# EAGLE design prism_idx_support (EAGLE 6.5.0)
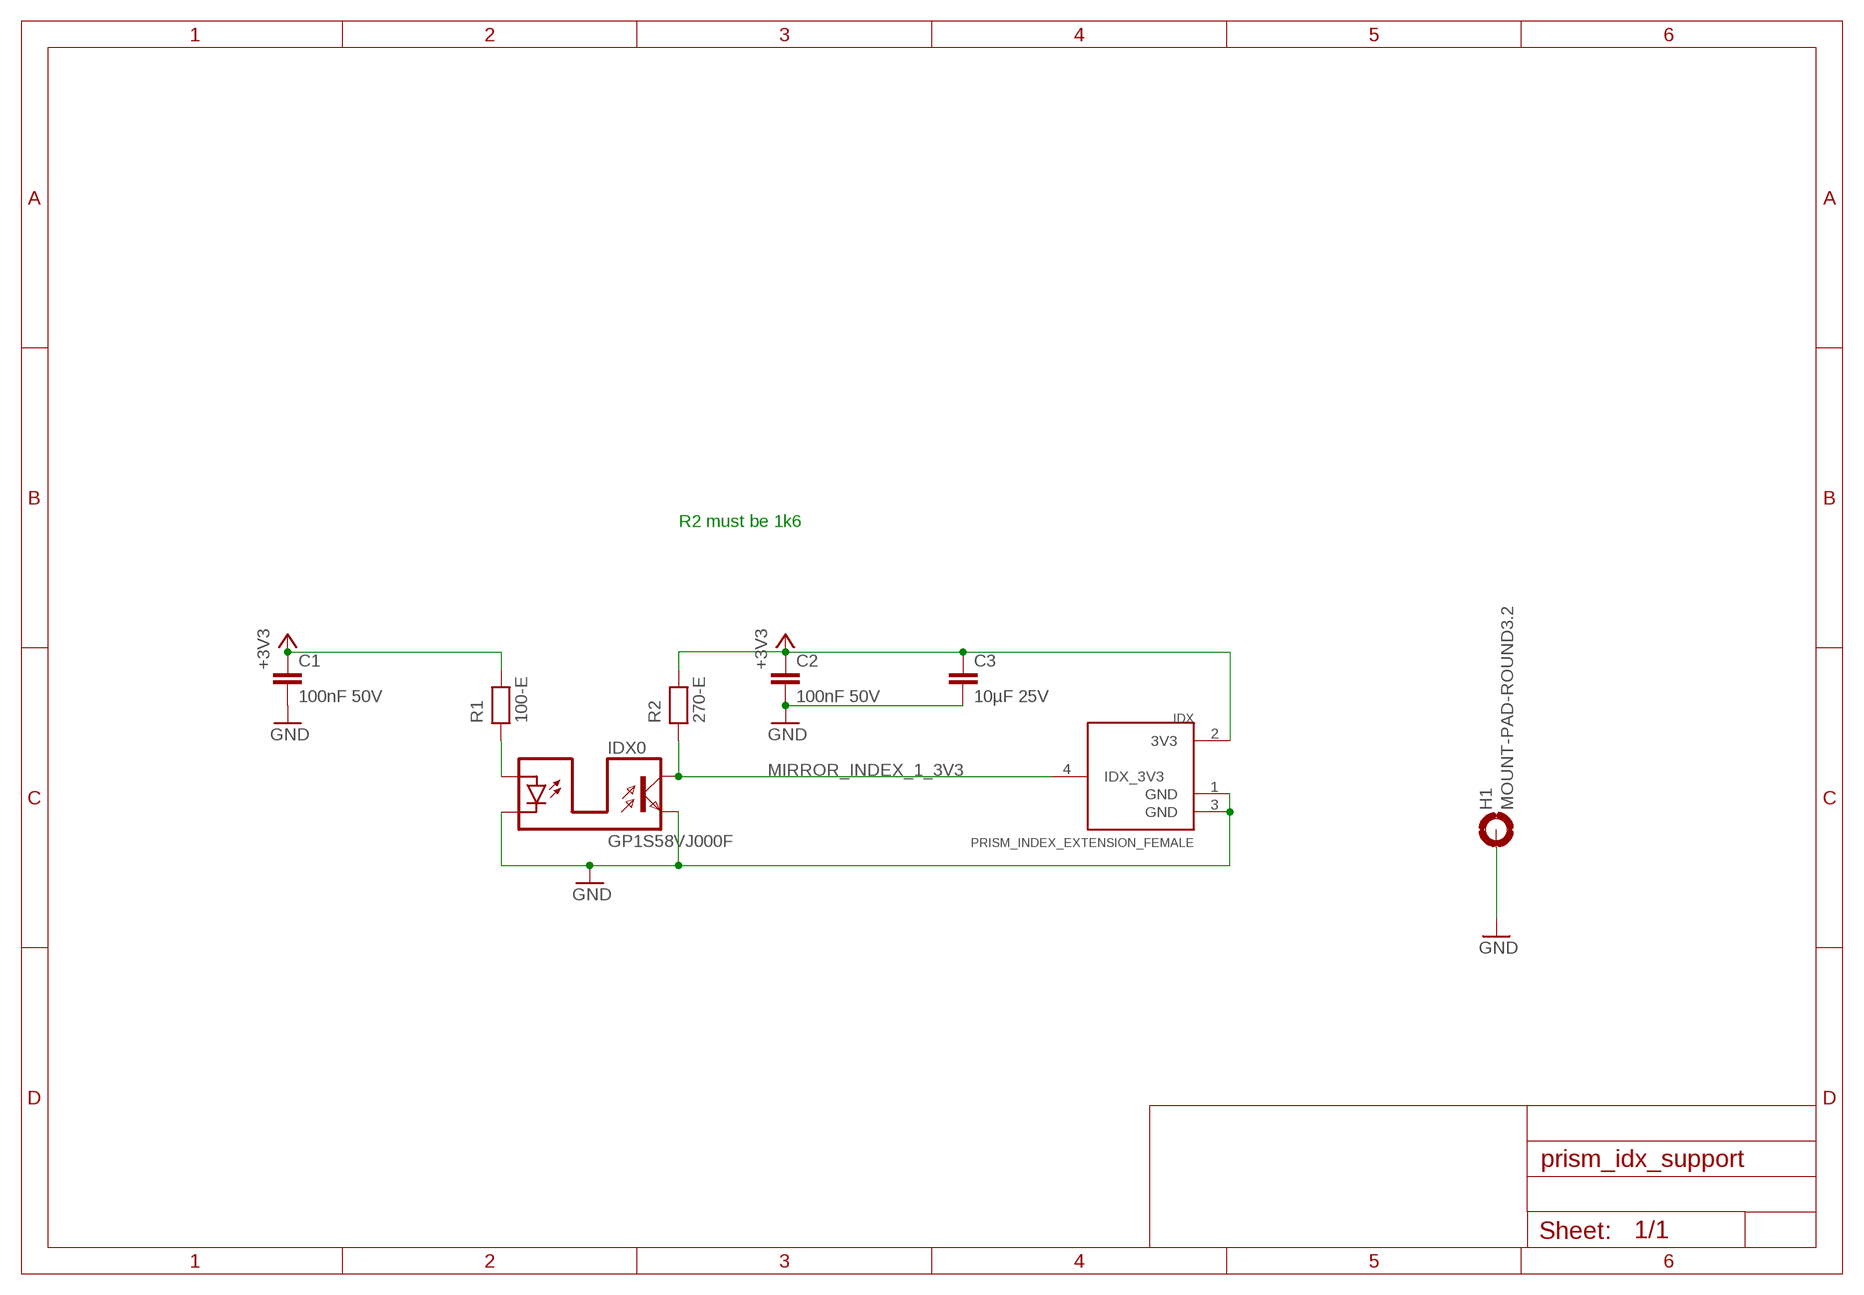
[diagram p0: schematic, sheet 1]

## Parts
C1  100nF 50V  100NF-F  [C0603]
C2  100nF 50V  100NF-F  [C0603]
C3  10µF 25V  10UF-C_25V  [C1210]
H1  MOUNT-PAD-ROUND3.2  [3,2-PAD]
IDX  PRISM_INDEX_EXTENSION_FEMALE  [PRISM_INDEX_EXTENSION_FEMALE]
IDX0  GP1S58VJ000F  [GP1S58VJ000F]
R1  100-E  [R0805]
R2  270-E  [R0805]

## Nets
+3V3: C1.1 C2.1 C3.1 IDX.2(3V3) R1.2 R2.2
GND: C1.2 C2.2 C3.2 H1.B3,2(MOUNT) IDX0.LED_C IDX0.TRANSISTOR_E IDX.1(GND) IDX.3(GND)
MIRROR_INDEX_1_3V3: IDX0.TRANSISTOR_C IDX.4(IDX_3V3) R2.1
N$57: IDX0.LED_A R1.1

## Notes on the sheet
- R2 must be 1k6

## Library data of the parts
C1 C2 = robotter_capacitor:100NF; MOUSER: 81-GRM188F51H104ZA01; RS: 723-5534
C3 = robotter_capacitor:10UF; MOUSER: 963-TMK316BJ106KL-T; RS: 766-1185
H1 = robotter_others:MOUNT-PAD-ROUND: MOUNTING PAD, round
IDX = robotter_others:PRISM_INDEX_EXTENSION
IDX0 = robotter_ic:GP1S58VJ000F: photo interrupter; MOUSER: 852-GP1S58VJ000F; RS: 667-5039
R1 = robotter_resistor:100; MOUSER: 603-AF0805FR-07100RL; RS: 223-0297
R2 = robotter_resistor:270; MOUSER: 652-CR0805-FX2700GLF; RS: 740-9019

## Board
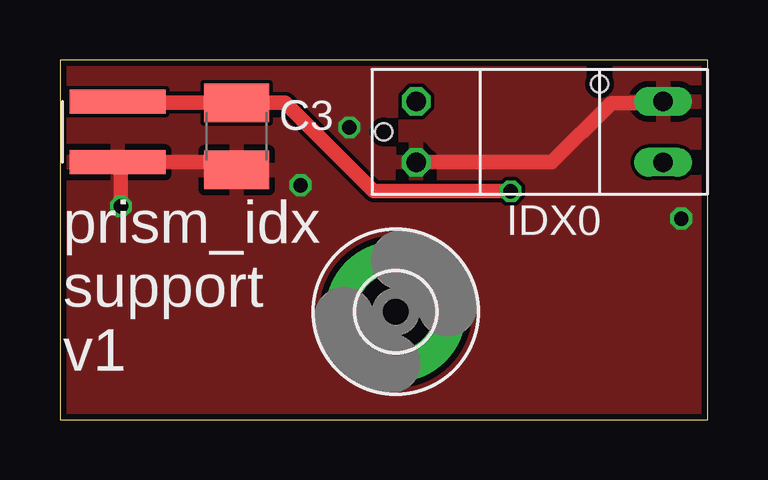
[diagram p1: board, top side]
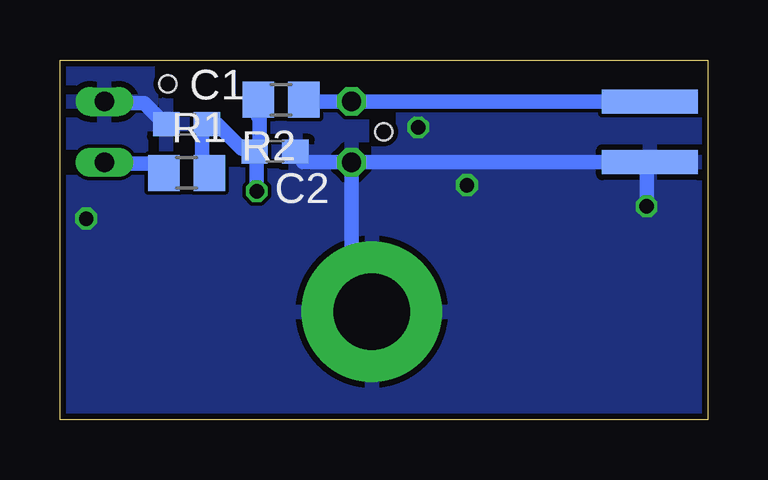
[diagram p2: board, bottom side, seen from below]

Size 27 x 15 mm. Coordinates in mm from the lower left corner, seen from the top.
Outline: 0,0 27,0 27,15 0,15 0,0
Copper layers (1*16): Top 0.035mm / dielectric 1.6mm / Bottom 0.035mm
Design rules "SeeedStudio_DRU_2layer": minimum track width 6mil, minimum drill 12mil, track to track 6mil, track to pad 6mil, pad to pad 6mil, via to via 6mil, smd to smd 0mil, copper to edge 10mil, drill to drill 10mil, minimum pad ring 6mil, minimum via ring 6mil, stop-mask expansion 2mil, vias tented up to drill 25mil, thermal gap 10mil

### Footprints (pad centres in the part's own frame; a part is rotated, then mirrored left to right if it is on the bottom)
C0603 = smd 1.1 x 1: 1 -0.85,0; 2 0.85,0
C1210 = smd 1.6 x 2.7: 1 -1.4,0; 2 1.4,0
3,2-PAD = drill 3.2 pad 5.842: B3,2 0,0
PRISM_INDEX_EXTENSION_FEMALE = smd 4 x 1: 1 0,-1.27; 2 0,1.27 | smd 4 x 1 bottom: 3 0,-1.27; 4 0,1.27
GP1S58VJ000F = drill 0.8 long: LED_A 5.15,-1.27; LED_C 5.15,1.27 | drill 0.8 octagon: TRANSISTOR_C -5.15,1.27; TRANSISTOR_E -5.15,-1.27 | hole 0.7: -6.5,0; 2.5,2
R0805 = smd 1.3 x 1.5: 1 -0.95,0; 2 0.95,0

### Placement (x,y rotation side)
C1  21.72,12.32 180 bottom
C2  18.03,11.18 0 bottom
C3  7.37,11.81 270 top
H1  14,4.5 0 top
IDX  2.4,12 0 top
IDX0  20,12 0 top
R1  21.72,10.29 0 bottom
R2  17.78,13.34 180 bottom

### Tracks (layer width: path | path; a pad name or v marks a point on that pad's centre or on a via)
+3V3  (via drill 0.6)
  Top 0.61: IDX.2 2.36,13.21 C3.1 9.39,13.21 13.08,9.53 v18.8,9.53
  Bottom 0.61: C2.1 19.43,11.3 20.45,12.32 C1.1 21.08,12.1 21.08,10.6 R1.2 | v18.8,9.53 18.8,11.01 C2.1 | C2.1 18.67,11.3 18.67,12.57 18.73,12.63 R2.2
GND  (via drill 0.6)
  Top 0.61: IDX0.TRANSISTOR_E 20.51,10.73 22.99,13.21 25.09,13.21 IDX0.LED_C | C3.2 6.67,10.73 IDX.3 2.54,10.49 v2.54,8.89
  Bottom 0.61: C1.2 22.82,12.53 23.5,13.21 25.53,13.21 25.65,13.08 25.34,13.08 IDX0.LED_C | C2.2 16.86,10.73 IDX0.TRANSISTOR_E | v2.54,8.89 2.54,10.73 IDX.3 IDX0.TRANSISTOR_E | H1.B3,2 14.85,5.07 IDX0.TRANSISTOR_E
  other vias: 12.06,12.19 10.03,9.78 25.91,8.38
  pour Bottom: 0,15 27,15 27,0 0,0
  pour Top: 0,15 27,15 27,0 0,0
MIRROR_INDEX_1_3V3
  Bottom 0.61: IDX.4 IDX0.TRANSISTOR_C 16.77,13.27 R2.1
N$57
  Bottom 0.61: IDX0.LED_A 25.09,10.67 23.05,10.67 R1.1

### Text on the board
tNames: prism_idx / support / v1